# EAGLE schematic Fan Control (EAGLE 6.2)
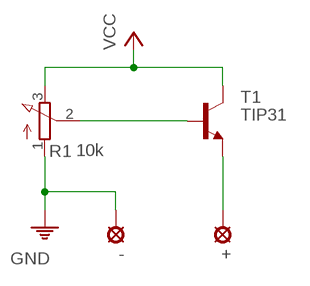
[diagram p0: schematic, sheet 1]

## Parts
+  LSP10  [LSP10]
-  LSP10  [LSP10]
R1  10k  3RP/1610N  [3RP/1610N]
T1  TIP31  [TO220]

## Nets
N$2: R1.2(S) T1.1(B)
N$3: +.MP T1.3(E)
PE: -.MP R1.1(A) ; supply symbol labelled GND
VCC: R1.3(E) T1.2(C)

## Library data of the parts
+ - = solpad:LSP10: SOLDER PAD drill 1.0 mm, distributor Buerklin, 12H555
R1 = pot:3RP/1610N: 16mm Potentiometer one level Source: http://www.alphapotentiometers.net/html/16mm_pot_2.html
T1 = transistor:TIP31: NPN Transistor Medium Power Linear Switching Applications Source: http://onsemi.com